# EAGLE design Atari_AV-Adapter (EAGLE 9.6.2)
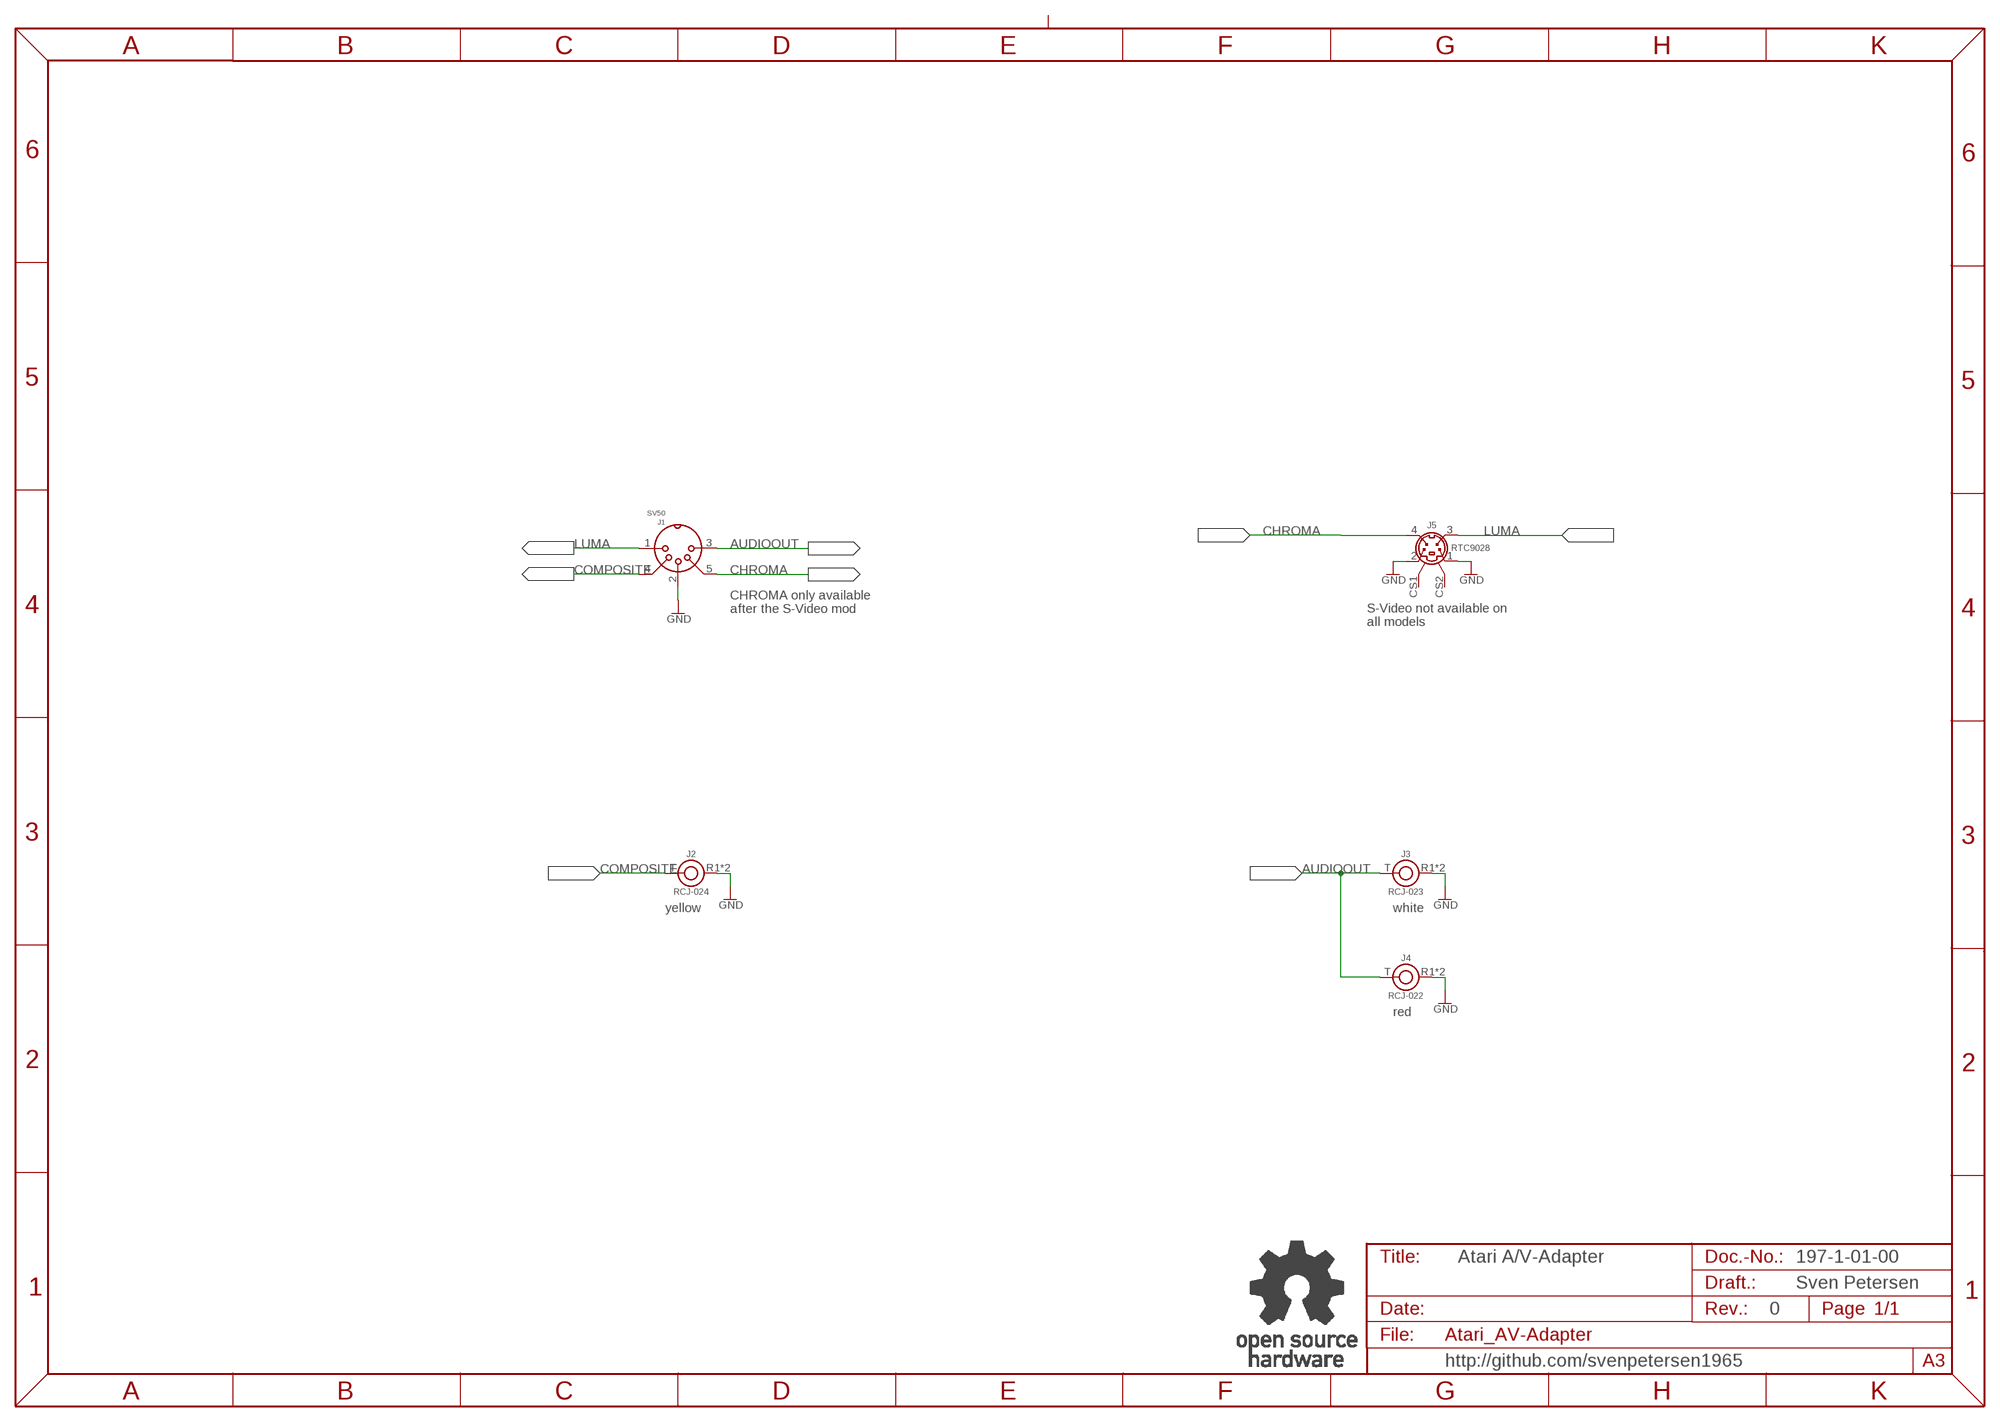
[diagram p0: schematic, sheet 1]

## Parts
J1  SV50  [SV50_INNER]
J2  RCJ-024  RCJ-02X  [RCJ-02X]
J3  RCJ-023  RCJ-02X  [RCJ-02X]
J4  RCJ-022  RCJ-02X  [RCJ-02X]
J5  RTC9028  [MINIDIN4_V]
U$25  OPEN_SOURCE_HW  [OPENHW]

## Nets
AUDIOOUT: J1.3 J3.T J4.T
CHROMA: J1.5 J5.4
COMPOSITE: J1.4 J2.T
GND: J1.2 J2.R1(R) J2.R2(R) J3.R1(R) J3.R2(R) J4.R1(R) J4.R2(R) J5.1 J5.2
LUMA: J1.1 J5.3
Unconnected: J5.CS1 J5.CS2

## Notes on the sheet
- CHROMA only available
  after the S-Video mod
- S-Video not available on 
  all models
- yellow | white
- red
- Atari A/V-Adapter | 197-1-01-00
- Sven Petersen
- 0
- http://github.com/svenpetersen1965

## Library data of the parts
J1 = Lumberg:SV50
J2-J4 = CUI_INC:RCJ-02X
J5 = RTConnector:RTC9028: Mini-DIN, 4p, vertical
U$25 = Logo:OPEN_SOURCE_HW

## Board
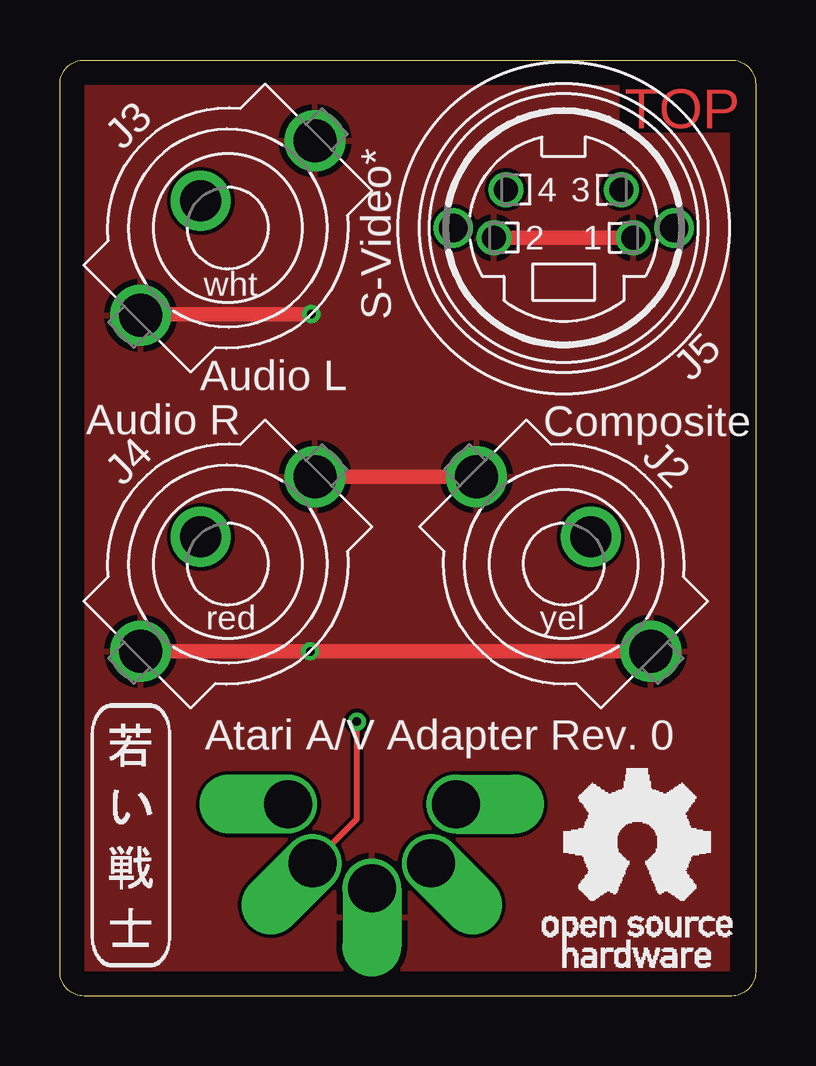
[diagram p1: board, top side]
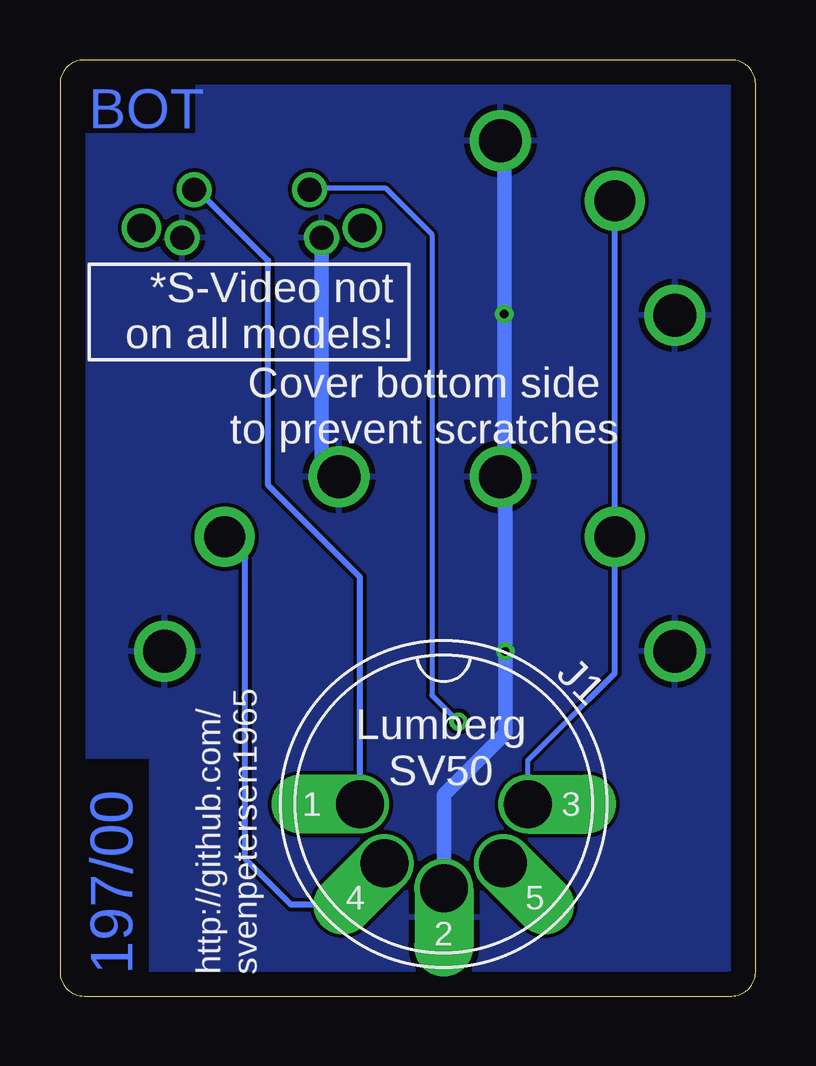
[diagram p2: board, bottom side, seen from below]

Size 29 x 39 mm. Coordinates in mm from the lower left corner, seen from the top.
Outline: 0,1 0,38 arc-90 1,39 28,39 arc-90 29,38 29,1 arc-90 28,0 1,0 arc-90 0,1
Copper layers (1*16): Top 0.035mm / dielectric 1.5mm / Bottom 0.035mm
Design rules "default *": minimum track width 6mil, minimum drill 0.35mm, track to track 6mil, track to pad 6mil, pad to pad 6mil, via to via 6mil, smd to smd 6mil, copper to edge 40mil, drill to drill 6mil, minimum pad ring 9mil, minimum via ring 8mil, stop-mask expansion 4mil, vias tented up to drill 25mil, thermal gap 10mil
tRestrict: 2 lines
bRestrict: 2 lines

### Footprints (pad centres in the part's own frame; a part is rotated, then mirrored left to right if it is on the bottom)
SV50_INNER = drill 2 pad 2.413 offset: 1 3.5,0; 2 0,3.5; 3 -3.5,0; 4 2.47,2.47; 5 -2.47,2.47
RCJ-02X = drill 1.8 pad 2.54: R1 -5.15,0; R2 5.15,0 | drill 1.7 pad 2.5: T 0,1.6
MINIDIN4_V = drill 1: 1 2.9,-0.4; 2 -2.9,-0.4; 3 2.4,1.6; 4 -2.4,1.6 | drill 1.2: CS1 4.6,0; CS2 -4.6,0

### Placement (x,y rotation side)
J1  13,8 180 bottom
J2  21,18 315 top
J3  7,32 45 top
J4  7,18 45 top
J5  21,32 0 top
U$22  [2LAYER]  23.52,36.15 0 top
U$23  [SVEN_TAG]  3,6.81 0 top
U$24  [PCB-TITLE/]  0.16,44.61 0 top  (outside the outline)
U$25  20.13,1.2 0 top

### Tracks (layer width: path | path; a pad name or v marks a point on that pad's centre or on a via)
AUDIOOUT
  Bottom 0.203: J1.3 9.5,9.82 6.94,12.38
  Bottom 0.254: 6.94,12.38 5.87,13.45 J4.T J3.T
CHROMA  (via drill 0.35)
  Top 0.254: J1.5 12.38,7.38 v12.38,11.43
  Bottom 0.203: v12.38,11.43 13.49,12.54 13.49,31.75 15.4,33.66 18.55,33.66 J5.4
COMPOSITE
  Bottom 0.254: J1.4 17.19,3.81 19.37,3.81 21.27,5.71 21.27,18.27 J2.T
GND  (via drill 0.35)
  Top 0.61: J5.2 J5.1 | J4.R1 v10.43,14.36 J2.R2 | J4.R2 J2.R1 | v10.48,28.42 3.42,28.42 J3.R1
  Bottom 0.61: J1.2 13,8.38 10.43,10.95 v10.43,14.36 10.43,21.43 J4.R2 10.48,21.81 v10.48,28.42 10.48,35.48 J3.R2 | J2.R1 18.1,22.38 J5.2
  pour Bottom: 0.95,0.79 0.95,38.05 27.84,38.05 27.84,0.79
  pour Top: 0.95,0.79 27.84,0.79 27.84,38.05 0.95,38.05
LUMA
  Bottom 0.254: J1.1 16.5,17.45 20.32,21.27 20.32,30.64 23.28,33.6 J5.3

### Text on the board
Bottom: 197/00
tPlace: S-Video* | wht | Audio L | Audio R | Composite | red | yel | Atari A/V Adapter Rev. 0
bPlace: *S-Video not / on all models! | Cover bottom side / to prevent scratches | Lumberg / SV50 | http://github.com/ / svenpetersen1965
Measures: DIN / Plug
Document: Sven Petersen | 197-2-01-00 | 2022 | 35µm | 2 | 0